# EAGLE design Thermistor (EAGLE 7.4.0)
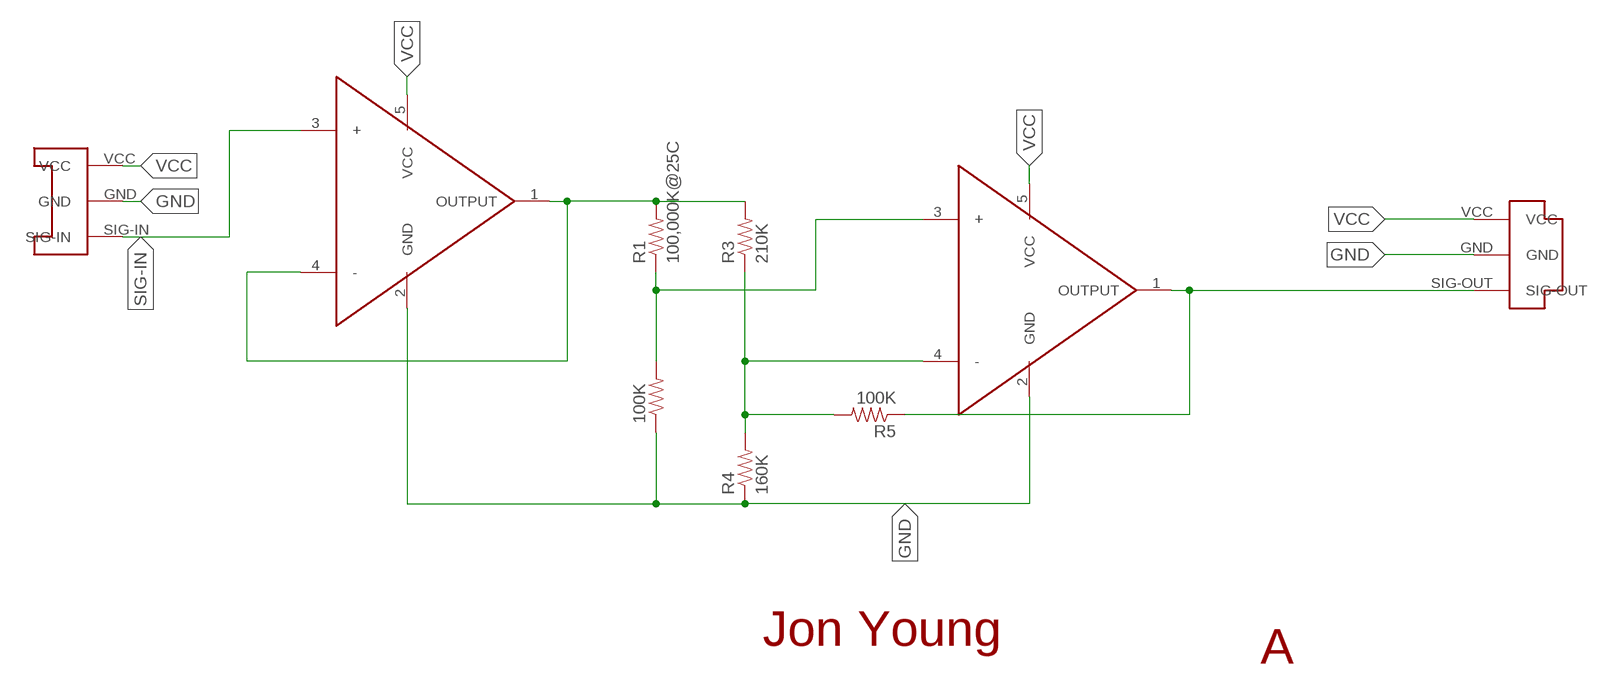
[diagram p0: schematic, sheet 1]

## Parts
100K  RESISTOR0603  [0603-RES]
R1  100,000K@25C  RESISTOR0603  [0603-RES]
R3  210K  RESISTOR0603  [0603-RES]
R4  160K  RESISTOR0603  [0603-RES]
R5  100K  RESISTOR0603  [0603-RES]
U$1  CONN-PLUG-3POS-3MM  [PLUG-3POS-3MM-SMD]
U$2  CONN-SOCKET-3POS-3MM  [SOCKET-3POS-3MM-SMD]
U$3  OPAMP-MCP6001SOT23-5  [SOT23-5]
U$4  OPAMP-MCP6001SOT23-5  [SOT23-5]

## Nets
GND: 100K.1 R4.1 U$1.GND U$2.GND U$3.2(GND) U$4.2(GND)
N$5: R5.1 U$1.SIG-OUT U$4.1(OUTPUT)
N$6: R3.1 R4.2 R5.2 U$4.4(-)
N$8: R1.2 R3.2 U$3.1(OUTPUT) U$3.4(-)
N$9: 100K.2 R1.1 U$4.3(+)
SIG-IN: U$2.SIG-IN U$3.3(+)
VCC: U$1.VCC U$2.VCC U$3.5(VCC) U$4.5(VCC)

## Notes on the sheet
- Jon Young
- A

## Library data of the parts
100K R1 R3-R5 = SparkFun-Resistors:RESISTOR: Resistor Basic schematic elements and footprints for 0603, 1206, and PTH resistors.
U$1 = EmbeddedPlayground:CONN-PLUG-3POS-3MM: Surface mount board to board connector. Female socket, 3 position.
U$2 = EmbeddedPlayground:CONN-SOCKET-3POS-3MM: Surface mount board to board connector. Female socket, 3 position.
U$3 U$4 = EmbeddedPlayground:OPAMP-MCP6001

## Board
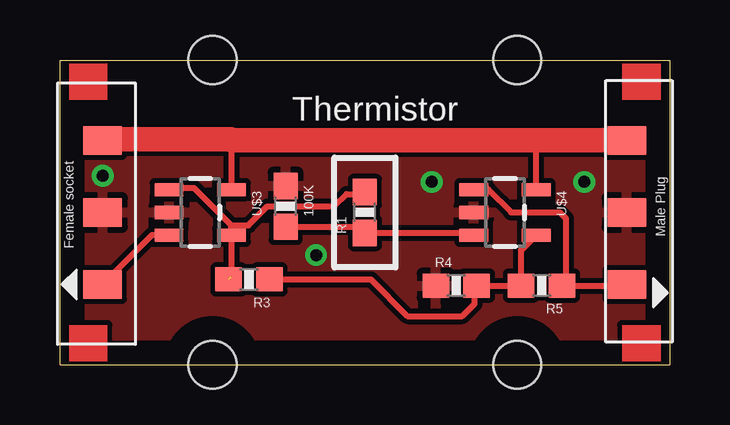
[diagram p1: board, top side]
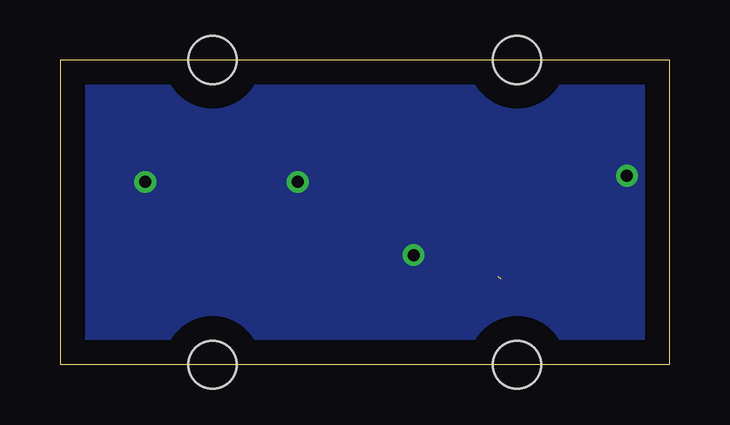
[diagram p2: board, bottom side, seen from below]

Size 25.4 x 12.7 mm. Coordinates in mm from the lower left corner, seen from the top.
Outline: 0,0 25.4,0 25.4,12.7 0,12.7 0,0
Copper layers (1*16): Top 0.035mm / dielectric 1.5mm / Bottom 0.035mm
Design rules "default": minimum track width 10mil, minimum drill 24mil, track to track 8mil, track to pad 8mil, pad to pad 8mil, via to via 8mil, smd to smd 8mil, copper to edge 40mil, drill to drill 8mil, minimum pad ring 10mil, minimum via ring 8mil, stop-mask expansion 4mil, vias tented up to drill 0mil, thermal gap 10mil
Holes 2 mm at 6.35,0 6.35,12.7 19.05,12.7 19.05,0

### Footprints (pad centres in the part's own frame; a part is rotated, then mirrored left to right if it is on the bottom)
0603-RES = smd 1.1 x 1: 1 -0.85,0; 2 0.85,0
PLUG-3POS-3MM-SMD = smd 1.2 x 1.6: GND 0,0; SIG-OUT 3,0; VCC -3,0
SOCKET-3POS-3MM-SMD = smd 1.2 x 1.6: GND 0,0; SIG-IN -3,0; VCC 3,0
SOT23-5 = smd 0.55 x 1.2: 1 -0.95,-1.3; 2 0,-1.3; 3 0.95,-1.3; 4 0.95,1.3; 5 -0.95,1.3

### Placement (x,y rotation side)
100K  9.4,6.6 270 top
R1  12.7,6.35 90 top
R3  7.87,3.56 180 top
R4  16.51,3.3 0 top
R5  20.07,3.3 180 top
U$1  23.62,6.35 270 top
U$2  1.78,6.35 90 top
U$3  5.84,6.35 270 top
U$4  18.54,6.35 270 top

### Tracks (layer width: path | path; a pad name or v marks a point on that pad's centre or on a via)
GND  (via drill 0.5)
  other vias: 1.78,7.87 15.49,7.62 21.84,7.62 10.67,4.57
  pour Top: -1.27,13.91 -1.02,-1.27 29.37,-1.27 29.12,13.91
  pour Bottom: -1.27,13.91 26.58,13.91 26.58,-1.27 -1.27,-1.27
N$5
  Top 0.254: U$4.1 17.85,7.3 18.8,6.35 20.83,6.35 21.08,6.1 21.08,3.47 R5.1 23.57,3.3 U$1.SIG-OUT
N$6
  Top 0.254: R3.1 12.95,3.56 14.48,2.03 16.76,2.03 17.27,2.54 17.27,3.21 R4.2 R5.2 19.22,4.77 U$4.4
N$8  (1 unrouted)
  Top 0.254: 7.14,5.81 U$3.4 7.14,3.67 | 7.14,5.81 5.59,7.37 4.61,7.37 U$3.1 | 7.14,5.81 7.84,5.81 8.64,6.6 11.43,6.6 11.94,7.11 12.61,7.11 R1.2
N$9
  Top 0.254: 100K.2 12.45,5.75 R1.1 17.14,5.5 U$4.3
SIG-IN
  Top 0.254: U$3.3 3.83,5.4 U$2.SIG-IN
VCC
  Top 0.254: U$4.5 19.84,9.32 19.81,9.35 | 7.14,9.37 U$3.5
  Top 1.016: U$2.VCC 1.83,9.4 7.11,9.4 7.14,9.37 7.16,9.35 19.81,9.35 U$1.VCC

### Text on the board
tPlace: Thermistor